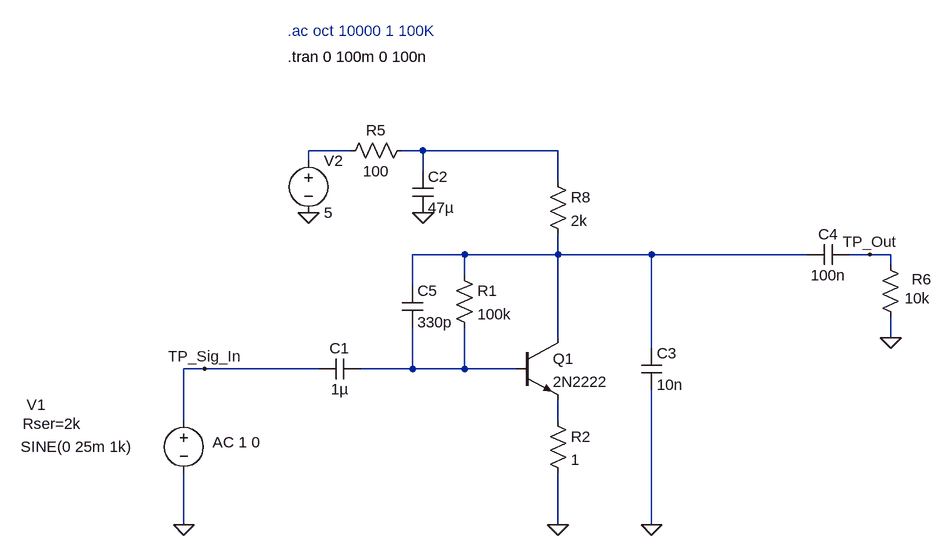
[diagram p0: schematic 4020 NPN Mic Amp 1.asc]
4020 NPN Mic Amp 1.asc, the LTspice schematic file:
Version 4
SHEET 1 1080 680
WIRE 16 -160 -48 -160
WIRE 128 -160 96 -160
WIRE 336 -160 128 -160
WIRE -48 -144 -48 -160
WIRE 128 -128 128 -160
WIRE 336 -112 336 -160
WIRE 192 0 112 0
WIRE 336 0 336 -32
WIRE 336 0 192 0
WIRE 480 0 336 0
WIRE 720 0 480 0
WIRE 816 0 784 0
WIRE 848 0 816 0
WIRE 848 16 848 0
WIRE 192 32 192 0
WIRE 112 48 112 0
WIRE 336 128 336 0
WIRE 848 128 848 96
WIRE 480 144 480 0
WIRE -208 176 -240 176
WIRE -32 176 -208 176
WIRE 112 176 112 112
WIRE 112 176 32 176
WIRE 192 176 192 112
WIRE 192 176 112 176
WIRE 272 176 192 176
WIRE -240 256 -240 176
WIRE 336 256 336 224
WIRE -240 416 -240 336
WIRE 336 416 336 336
WIRE 480 416 480 208
FLAG 128 -64 0
FLAG -48 -64 0
FLAG -240 416 0
FLAG 336 416 0
FLAG 848 128 0
FLAG 816 0 TP_Out
FLAG -208 176 TP_Sig_In
FLAG 480 416 0
SYMBOL voltage -240 240 R0
WINDOW 123 44 49 Left 2
WINDOW 39 -248 20 Left 2
WINDOW 3 -251 56 Left 2
WINDOW 0 -242 -9 Left 2
SYMATTR Value2 AC 1 0
SYMATTR SpiceLine Rser=2k
SYMATTR Value SINE(0 25m 1k)
SYMATTR InstName V1
SYMBOL voltage -48 -160 R0
WINDOW 123 0 0 Left 0
WINDOW 39 0 0 Left 0
SYMATTR InstName V2
SYMATTR Value 5
SYMBOL cap 32 160 R90
WINDOW 0 0 32 VBottom 2
WINDOW 3 32 32 VTop 2
SYMATTR InstName C1
SYMATTR Value 1µ
SYMBOL res 176 16 R0
SYMATTR InstName R1
SYMATTR Value 100k
SYMBOL npn 272 128 R0
SYMATTR InstName Q1
SYMATTR Value 2N2222
SYMBOL res 112 -176 R90
WINDOW 0 0 56 VBottom 2
WINDOW 3 32 56 VTop 2
SYMATTR InstName R5
SYMATTR Value 100
SYMBOL res 864 112 R180
WINDOW 0 -47 74 Left 2
WINDOW 3 -45 45 Left 2
SYMATTR InstName R6
SYMATTR Value 10k
SYMBOL cap 112 -128 R0
SYMATTR InstName C2
SYMATTR Value 47µ
SYMBOL cap 784 -16 R90
WINDOW 0 0 32 VBottom 2
WINDOW 3 32 32 VTop 2
SYMATTR InstName C4
SYMATTR Value 100n
SYMBOL res 320 -128 R0
SYMATTR InstName R8
SYMATTR Value 2k
SYMBOL cap 464 144 R0
SYMATTR InstName C3
SYMATTR Value 10n
SYMBOL cap 96 48 R0
SYMATTR InstName C5
SYMATTR Value 330p
SYMBOL res 320 240 R0
SYMATTR InstName R2
SYMATTR Value 1
TEXT -80 -304 Left 2 !.tran 0 100m 0 100n
TEXT -80 -344 Left 2 ;.ac oct 10000 1 100K

The netlist it stands for:
* 4020 NPN Mic Amp 1.asc
V1 TP_Sig_In 0 SINE(0 25m 1k) AC 1 0 Rser=2k
V2 N001 0 5
C1 N004 TP_Sig_In 1µ
R1 N003 N004 100k
Q1 N003 N004 N005 0 2N2222
R5 N002 N001 100
R6 0 TP_Out 10k
C2 N002 0 47µ
C4 TP_Out N003 100n
R8 N002 N003 2k
C3 N003 0 10n
C5 N003 N004 330p
R2 N005 0 1
.model NPN NPN
.model PNP PNP
.lib standard.bjt
.tran 0 100m 0 100n
* .ac oct 10000 1 100K
.backanno
.end